# Altium project 3.3 Buck.PrjPcb
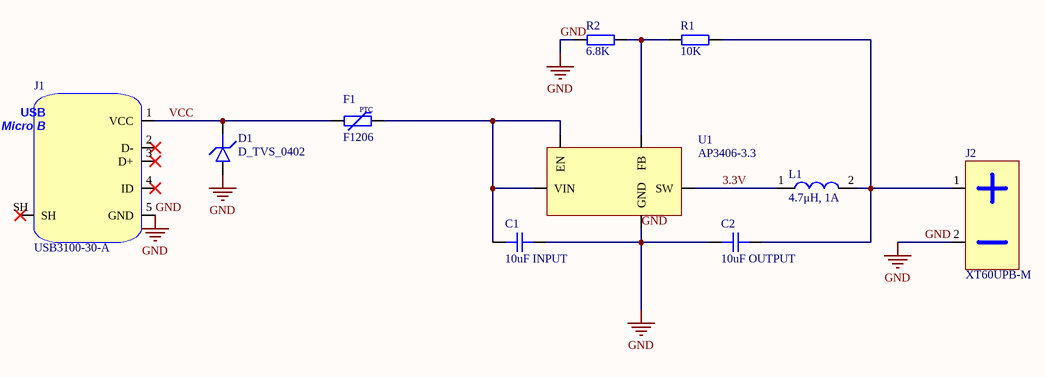
[diagram p0: 3.3 Buck.SchDoc]
1 sheet, 10 parts. Net scope: global (net labels, ports and power ports of the same name join across sheets).
Board file: 3.3 Buck.PcbDoc

## Sheet 3.3 Buck.SchDoc
size A; SheetNumber: 1; SheetTotal: 1

### Parts
C1  10uF INPUT  [CAP_0805]
C2  10uF OUTPUT  [CAP_0805]
D1  D_TVS_0402  [D_0402]
F1  F1206  [FUSE_1206]
J1  USB3100-30-A  [USB3100-30-A]
J2  XT60UPB-M  [XT60UPB-M]
L1  4.7μH, 1A  [4.7µH, 1A]
R1  10K  [RES_0805]
R2  6.8K  [RES_0805]
U1  AP3406-3.3  [SOT-23]

### Nets
GND: C1.2 C2.1 D1.A J1.5(GND) J2.2(V-) R2.1 U1.2(GND)
3.3V: L1.1 U1.3(SW)
VCC: D1.K F1.1 J1.1(VCC)
NetC1_1: C1.1 F1.2 U1.1(EN) U1.4(VIN)
NetC2_2: C2.2 J2.1(V+) L1.2 R1.2
NetR1_1: R1.1 R2.2 U1.5(FB)

Not connected (* = marked no-connect by the designer): J1 2(D-)* 3(D+)* 4(ID)* SH*

### Notes on the sheet
- (in symbol FUSE_PPTC_1206) PTC
- (in symbol USB3100-30-A) USB; Micro B

### Library data of the parts
C1 C2 = CAP_0805: Capacitor SMD 0805; Manufacturer: *; Manufacturer Part Number: *; Distributor Link: *; LCSC: *; Rating: *; Dielectric: *
D1 = D_TVS_0402: Diode TVS / ESD 0402
F1 = FUSE_PPTC_1206: Fuse PPTC SMD 1206; Manufacturer: *; Manufacturer Part Number: *
J1 = USB3100-30-A: USB Connector Type Micro B 2.0 SMD Reverse Mount; Manufacturer: GCT; Manufacturer Part Number: USB3100-30-A
J2 = XT60UPB-M: XT60 vertical male 2-pin AMASS; Manufacturer: AMASS; Manufacturer Part Number: XT60UPB-M
L1 = LQH3NPN4R7MM0L: FIXED IND 4.7UH 0.88A 156MOHM; Manufacturer: Murata; Core Material: Ferrite; Saturation Current: 880mA; Tolerance: 20%; Shielding: Shielded; Self Resonant Frequency: 65MHz; Current Rating: 1.25A; DC Resistance (DCR): 156mR; Test Frequency: 1MHz; Supplier: Farnell; Supplier Part Number: 2470318; Manufacturer Part Number: LQH3NPN4R7MM0L; RoHS: Yes; Category: Fixed Inductors; Pricing: 1=0.31, 50=0.188, 100=0.171, 250=0.14, 500=0.124, 1000=0.109, 5000=0.0975 (GBP); Mounting Technology: Surface Mount; Case/Package: 1212; Case Code (Imperial): 1212; Min Operating Temperature: -40°C; Max Operating Temperature: 85°C; Packaging: Tape and Reel; Package Quantity: 1; Value: 4.7uH; Max DC Current: 1.25A; DC Current: 1.25A; Inductance Tolerance: 20%; Series: LQH3NP_M0; Length: 0.118inch; Width: 0.118inch; Height: 1.5mm; Height - Seated (Max): 0.059inch; Depth: 3.2mm; Military Standard: Not; Reach SVHC Compliant: No; Lead Free: Lead Free; RoHS Compliant: Yes; ComponentLink1URL: https://datasheet.ciiva.com/30489/0900766b81256151-30489978.pdf?src-supplier=Rs; ComponentLink1Description: https://datasheet.ciiva.com/30489/0900766b81256151-30489978.pdf?src-supplier=Rs; ComponentLink2URL: https://datasheet.ciiva.com/3080/l0075s0103lqh3np-m0-3080279.pdf?src-supplier=Avnet; ComponentLink2Description: https://datasheet.ciiva.com/3080/l0075s0103lqh3np-m0-3080279.pdf?src-supplier=Avnet; ComponentLink3URL: https://datasheet.ciiva.com/6705/l0075s0103lqh3np-m0-6705701.pdf?src-supplier=Digikey; ComponentLink3Description: https://datasheet.ciiva.com/6705/l0075s0103lqh3np-m0-6705701.pdf?src-supplier=Digikey
R1 R2 = RES_0805: Resistor SMD 0805; Manufacturer: *; Manufacturer Part Number: *; Distributor Link: *; LCSC: *
U1 = AP3406KT